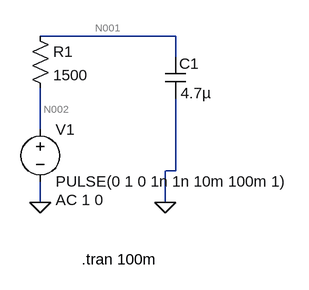
[diagram p0: schematic Draft3.asc]
Draft3.asc, the LTspice schematic file:
Version 4
SHEET 1 880 680
WIRE 240 -192 32 -192
WIRE 240 -160 240 -192
WIRE 32 -48 32 -112
WIRE 240 16 240 -96
WIRE 240 16 224 16
WIRE 32 64 32 32
WIRE 224 64 224 16
FLAG 32 64 0
FLAG 224 64 0
SYMBOL cap 224 -160 R0
WINDOW 0 22 10 Left 2
SYMATTR InstName C1
SYMATTR Value 4.7µ
SYMBOL res 16 -208 R0
SYMATTR InstName R1
SYMATTR Value 1500
SYMBOL voltage 32 -64 R0
WINDOW 123 24 124 Left 2
WINDOW 39 0 0 Left 0
SYMATTR InstName V1
SYMATTR Value PULSE(0 1 0 1n 1n 10m 100m 1)
SYMATTR Value2 AC 1 0
TEXT 96 152 Left 2 !.tran 100m

The netlist it stands for:
* Draft3.asc
C1 N001 0 4.7µ
R1 N001 N002 1500
V1 N002 0 PULSE(0 1 0 1n 1n 10m 100m 1) AC 1 0
.tran 100m
.backanno
.end

* Results of the author's LTspice run, read from the files saved beside the schematic
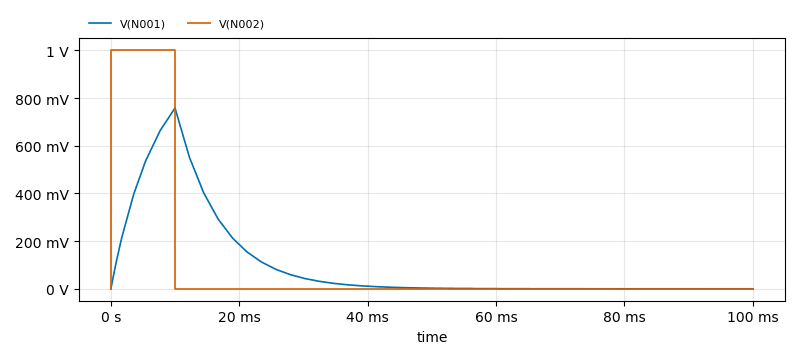
[diagram p1: Transient Analysis of Draft3.asc, plotted from the saved traces]
* Transient Analysis, 1 run:
*   V(N001): min 0 V, max 757.9 mV, average 100.2 mV, rms 217.4 mV, last 2.164 µV
*   V(N002): min 0 V, max 1 V, average 100 mV, rms 316.2 mV, last 0 V